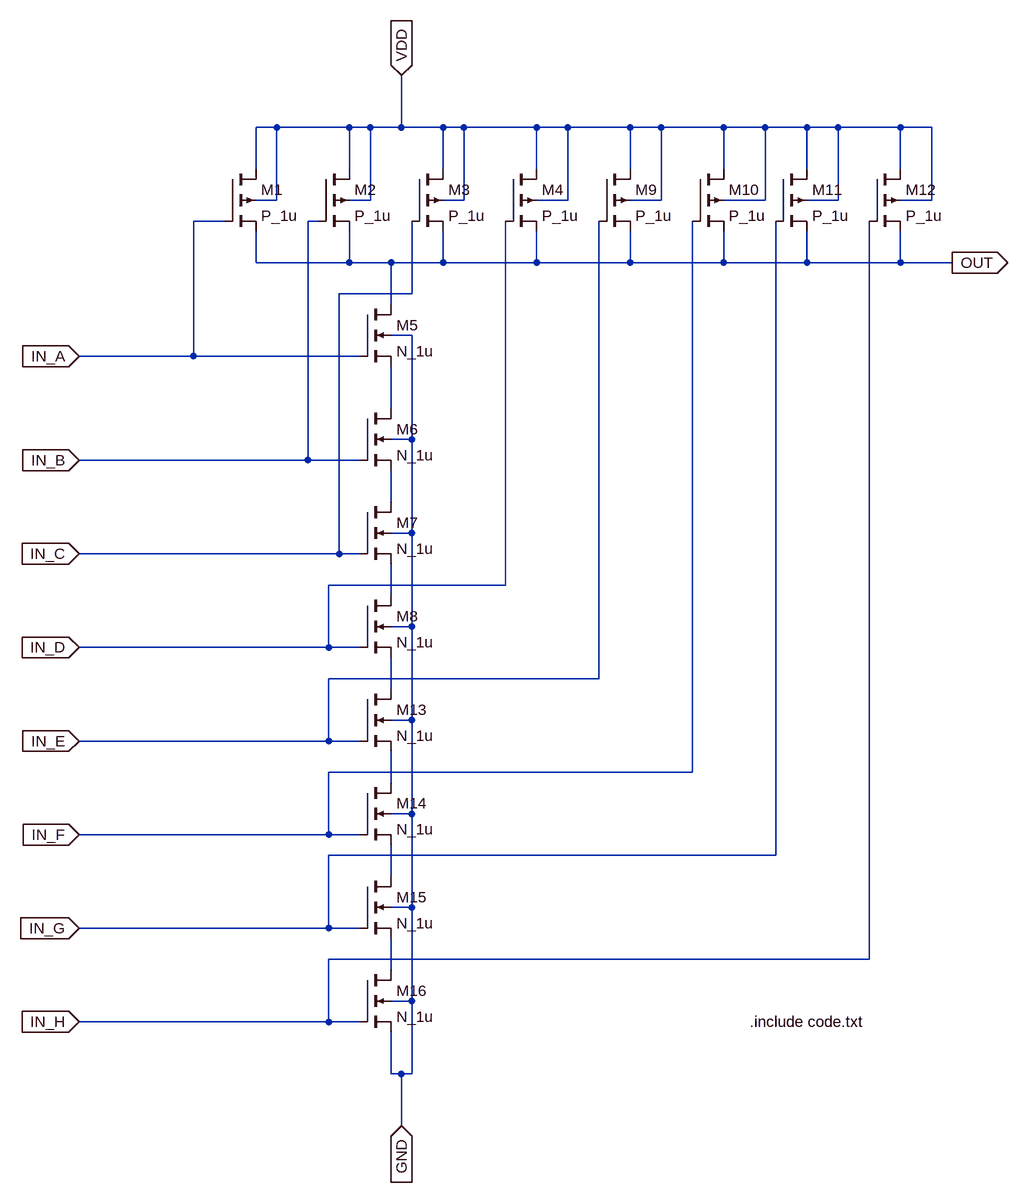
[diagram p0: schematic Circuit2_Part3_8inputNANDUsingMosfets.asc]
Circuit2_Part3_8inputNANDUsingMosfets.asc, the LTspice schematic file:
Version 4
SHEET 1 1244 1632
WIRE 96 -16 64 -16
WIRE 208 -16 96 -16
WIRE 240 -16 208 -16
WIRE 288 -16 288 -96
WIRE 288 -16 240 -16
WIRE 352 -16 288 -16
WIRE 384 -16 352 -16
WIRE 496 -16 384 -16
WIRE 544 -16 496 -16
WIRE 640 -16 544 -16
WIRE 688 -16 640 -16
WIRE 784 -16 688 -16
WIRE 848 -16 784 -16
WIRE 912 -16 848 -16
WIRE 960 -16 912 -16
WIRE 1056 -16 960 -16
WIRE 1104 -16 1056 -16
WIRE 64 48 64 -16
WIRE 208 48 208 -16
WIRE 352 48 352 -16
WIRE 496 48 496 -16
WIRE 640 48 640 -16
WIRE 784 48 784 -16
WIRE 912 48 912 -16
WIRE 1056 48 1056 -16
WIRE 96 96 96 -16
WIRE 96 96 64 96
WIRE 240 96 240 -16
WIRE 240 96 208 96
WIRE 384 96 384 -16
WIRE 384 96 352 96
WIRE 544 96 544 -16
WIRE 544 96 496 96
WIRE 688 96 688 -16
WIRE 688 96 640 96
WIRE 848 96 848 -16
WIRE 848 96 784 96
WIRE 960 96 960 -16
WIRE 960 96 912 96
WIRE 1104 96 1104 -16
WIRE 1104 96 1056 96
WIRE 16 128 -32 128
WIRE 160 128 144 128
WIRE 64 192 64 144
WIRE 208 192 208 144
WIRE 208 192 64 192
WIRE 272 192 208 192
WIRE 352 192 352 144
WIRE 352 192 272 192
WIRE 496 192 496 144
WIRE 496 192 352 192
WIRE 640 192 640 144
WIRE 640 192 496 192
WIRE 784 192 784 144
WIRE 784 192 640 192
WIRE 912 192 912 144
WIRE 912 192 784 192
WIRE 1056 192 1056 144
WIRE 1056 192 912 192
WIRE 1136 192 1056 192
WIRE 304 240 304 128
WIRE 304 240 192 240
WIRE 272 256 272 192
WIRE 304 304 272 304
WIRE -32 336 -32 128
WIRE -32 336 -208 336
WIRE 224 336 -32 336
WIRE 272 416 272 352
WIRE 304 464 304 304
WIRE 304 464 272 464
WIRE 144 496 144 128
WIRE 144 496 -208 496
WIRE 224 496 144 496
WIRE 272 560 272 512
WIRE 304 608 304 464
WIRE 304 608 272 608
WIRE 192 640 192 240
WIRE 192 640 -208 640
WIRE 224 640 192 640
WIRE 448 688 448 128
WIRE 448 688 176 688
WIRE 272 704 272 656
WIRE 304 752 304 608
WIRE 304 752 272 752
WIRE 176 784 176 688
WIRE 176 784 -208 784
WIRE 224 784 176 784
WIRE 592 832 592 128
WIRE 592 832 176 832
WIRE 272 848 272 800
WIRE 304 896 304 752
WIRE 304 896 272 896
WIRE 176 928 176 832
WIRE 176 928 -208 928
WIRE 224 928 176 928
WIRE 736 976 736 128
WIRE 736 976 176 976
WIRE 272 992 272 944
WIRE 304 1040 304 896
WIRE 304 1040 272 1040
WIRE 176 1072 176 976
WIRE 176 1072 -208 1072
WIRE 224 1072 176 1072
WIRE 864 1104 864 128
WIRE 864 1104 176 1104
WIRE 272 1136 272 1088
WIRE 304 1184 304 1040
WIRE 304 1184 272 1184
WIRE 176 1216 176 1104
WIRE 176 1216 -208 1216
WIRE 224 1216 176 1216
WIRE 1008 1264 1008 128
WIRE 1008 1264 176 1264
WIRE 272 1280 272 1232
WIRE 304 1328 304 1184
WIRE 304 1328 272 1328
WIRE 176 1360 176 1264
WIRE 176 1360 -208 1360
WIRE 224 1360 176 1360
WIRE 272 1440 272 1376
WIRE 288 1440 272 1440
WIRE 304 1440 304 1328
WIRE 304 1440 288 1440
WIRE 288 1520 288 1440
FLAG -208 336 IN_A
IOPIN -208 336 In
FLAG -208 496 IN_B
IOPIN -208 496 In
FLAG -208 640 IN_C
IOPIN -208 640 In
FLAG -208 784 IN_D
IOPIN -208 784 In
FLAG 288 -96 VDD
IOPIN 288 -96 In
FLAG 1136 192 OUT
IOPIN 1136 192 Out
FLAG 288 1520 GND
IOPIN 288 1520 In
FLAG -208 928 IN_E
IOPIN -208 928 In
FLAG -208 1072 IN_F
IOPIN -208 1072 In
FLAG -208 1216 IN_G
IOPIN -208 1216 In
FLAG -208 1360 IN_H
IOPIN -208 1360 In
SYMBOL pmos4 16 48 R0
SYMATTR InstName M1
SYMATTR Value P_1u
SYMATTR Value2 l=1u w=10u
SYMBOL pmos4 160 48 R0
SYMATTR InstName M2
SYMATTR Value P_1u
SYMATTR Value2 l=1u w=10u
SYMBOL pmos4 304 48 R0
SYMATTR InstName M3
SYMATTR Value P_1u
SYMATTR Value2 l=1u w=10u
SYMBOL pmos4 448 48 R0
SYMATTR InstName M4
SYMATTR Value P_1u
SYMATTR Value2 l=1u w=10u
SYMBOL nmos4 224 256 R0
SYMATTR InstName M5
SYMATTR Value N_1u
SYMATTR Value2 l=1u w=10u
SYMBOL nmos4 224 416 R0
SYMATTR InstName M6
SYMATTR Value N_1u
SYMATTR Value2 l=1u w=10u
SYMBOL nmos4 224 560 R0
SYMATTR InstName M7
SYMATTR Value N_1u
SYMATTR Value2 l=1u w=10u
SYMBOL nmos4 224 704 R0
SYMATTR InstName M8
SYMATTR Value N_1u
SYMATTR Value2 l=1u w=10u
SYMBOL pmos4 592 48 R0
SYMATTR InstName M9
SYMATTR Value P_1u
SYMATTR Value2 l=1u w=10u
SYMBOL pmos4 736 48 R0
SYMATTR InstName M10
SYMATTR Value P_1u
SYMATTR Value2 l=1u w=10u
SYMBOL pmos4 864 48 R0
SYMATTR InstName M11
SYMATTR Value P_1u
SYMATTR Value2 l=1u w=10u
SYMBOL pmos4 1008 48 R0
SYMATTR InstName M12
SYMATTR Value P_1u
SYMATTR Value2 l=1u w=10u
SYMBOL nmos4 224 848 R0
SYMATTR InstName M13
SYMATTR Value N_1u
SYMATTR Value2 l=1u w=10u
SYMBOL nmos4 224 992 R0
SYMATTR InstName M14
SYMATTR Value N_1u
SYMATTR Value2 l=1u w=10u
SYMBOL nmos4 224 1136 R0
SYMATTR InstName M15
SYMATTR Value N_1u
SYMATTR Value2 l=1u w=10u
SYMBOL nmos4 224 1280 R0
SYMATTR InstName M16
SYMATTR Value N_1u
SYMATTR Value2 l=1u w=10u
TEXT 824 1360 Left 2 !.include code.txt

The netlist it stands for:
* Circuit2_Part3_8inputNANDUsingMosfets.asc
M1 VDD IN_A OUT VDD P_1u l=1u w=10u
M2 VDD IN_B OUT VDD P_1u l=1u w=10u
M3 VDD IN_C OUT VDD P_1u l=1u w=10u
M4 VDD IN_D OUT VDD P_1u l=1u w=10u
M5 OUT IN_A N001 GND N_1u l=1u w=10u
M6 N001 IN_B N002 GND N_1u l=1u w=10u
M7 N002 IN_C N003 GND N_1u l=1u w=10u
M8 N003 IN_D N004 GND N_1u l=1u w=10u
M9 VDD IN_E OUT VDD P_1u l=1u w=10u
M10 VDD IN_F OUT VDD P_1u l=1u w=10u
M11 VDD IN_G OUT VDD P_1u l=1u w=10u
M12 VDD IN_H OUT VDD P_1u l=1u w=10u
M13 N004 IN_E N005 GND N_1u l=1u w=10u
M14 N005 IN_F N006 GND N_1u l=1u w=10u
M15 N006 IN_G N007 GND N_1u l=1u w=10u
M16 N007 IN_H GND GND N_1u l=1u w=10u
.model NMOS NMOS
.model PMOS PMOS
.lib standard.mos
.include code.txt
.backanno
.end